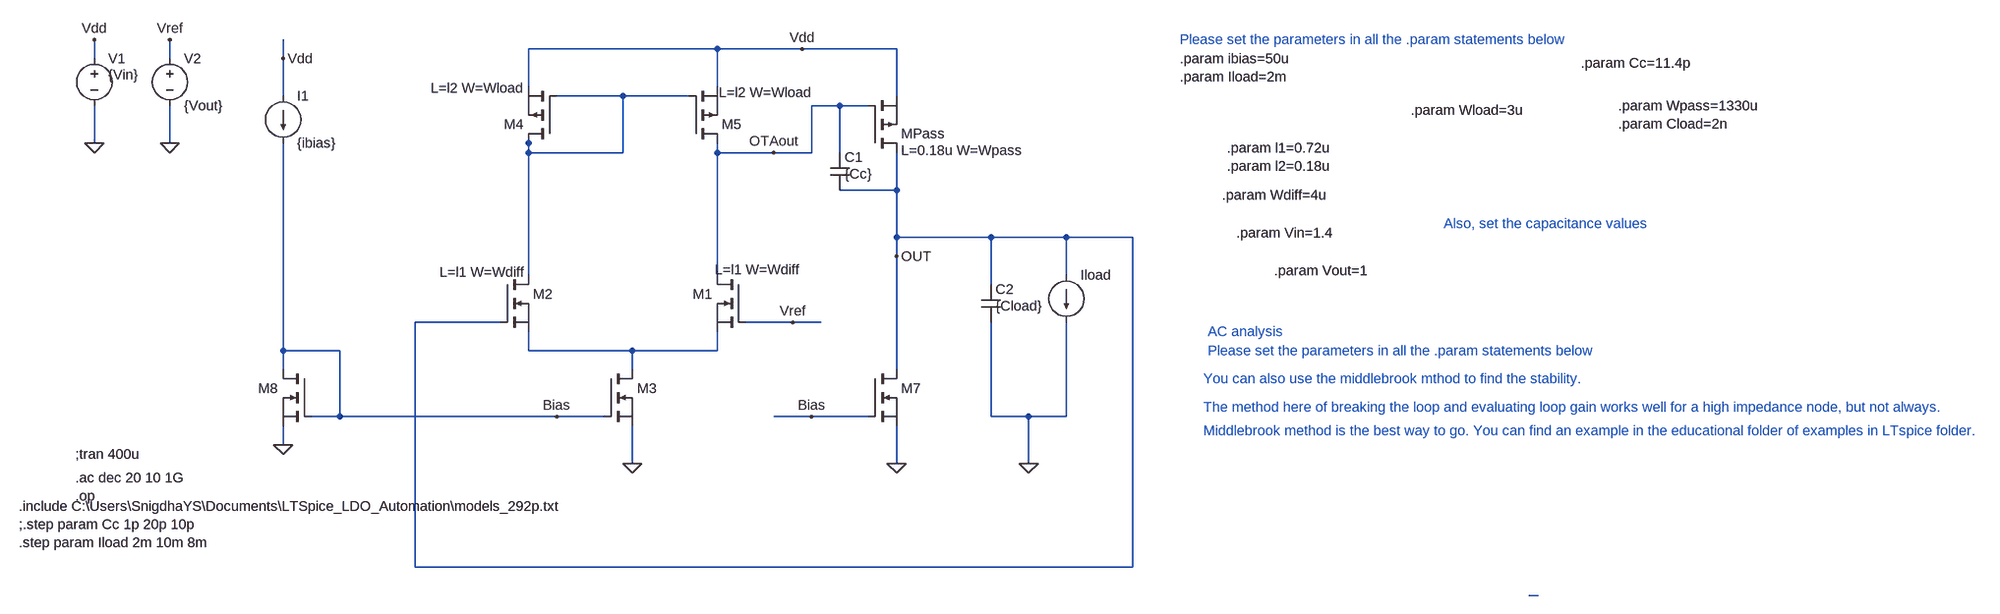
[diagram p0: schematic LDO_PSRR_IIIT.asc]
LDO_PSRR_IIIT.asc, the LTspice schematic file:
Version 4
SHEET 1 5048 1020
WIRE 288 -288 -32 -288
WIRE 432 -288 288 -288
WIRE 592 -288 432 -288
WIRE -768 -272 -768 -304
WIRE -640 -272 -640 -304
WIRE -448 -272 -448 -304
WIRE -32 -224 -32 -288
WIRE 288 -224 288 -288
WIRE -448 -208 -448 -272
WIRE 128 -208 16 -208
WIRE 240 -208 128 -208
WIRE 592 -208 592 -288
WIRE 496 -192 448 -192
WIRE 544 -192 496 -192
WIRE -768 -128 -768 -192
WIRE -640 -128 -640 -192
WIRE -32 -128 -32 -144
WIRE -32 -112 -32 -128
WIRE 128 -112 128 -208
WIRE 128 -112 -32 -112
WIRE 288 -112 288 -128
WIRE 384 -112 288 -112
WIRE 448 -112 448 -192
WIRE 448 -112 384 -112
WIRE 496 -112 496 -192
WIRE 592 -48 592 -112
WIRE 592 -48 496 -48
WIRE 592 32 592 -48
WIRE 752 32 592 32
WIRE 880 32 752 32
WIRE 992 32 880 32
WIRE 592 64 592 32
WIRE -32 96 -32 -112
WIRE 288 96 288 -112
WIRE 880 96 880 32
WIRE 752 112 752 32
WIRE -80 176 -224 176
WIRE 416 176 336 176
WIRE 464 176 416 176
WIRE -448 224 -448 -128
WIRE -352 224 -448 224
WIRE -32 224 -32 192
WIRE 144 224 -32 224
WIRE 288 224 288 192
WIRE 288 224 144 224
WIRE -448 256 -448 224
WIRE 144 256 144 224
WIRE 592 256 592 64
WIRE -352 336 -352 224
WIRE -352 336 -400 336
WIRE 16 336 -352 336
WIRE 96 336 16 336
WIRE 448 336 384 336
WIRE 544 336 448 336
WIRE 752 336 752 176
WIRE 816 336 752 336
WIRE 880 336 880 176
WIRE 880 336 816 336
WIRE -448 384 -448 352
WIRE 144 416 144 352
WIRE 592 416 592 352
WIRE 816 416 816 336
WIRE -224 592 -224 176
WIRE 992 592 992 32
WIRE 992 592 -224 592
WIRE 1680 640 1664 640
FLAG 144 416 0
FLAG 592 416 0
FLAG 448 336 Bias
FLAG 16 336 Bias
FLAG 592 64 OUT
FLAG -768 -128 0
FLAG -768 -304 Vdd
FLAG 432 -288 Vdd
FLAG -640 -128 0
FLAG -640 -304 Vref
FLAG 416 176 Vref
FLAG -448 384 0
FLAG -448 -272 Vdd
FLAG 816 416 0
FLAG 384 -112 OTAout
DATAFLAG 672 32 "$"
DATAFLAG -80 336 "$"
DATAFLAG 16 224 "$"
DATAFLAG 80 -112 "$"
DATAFLAG 160 -288 "$"
DATAFLAG 288 -16 "$"
SYMBOL nmos 336 96 M0
WINDOW 3 56 72 Invisible 2
WINDOW 39 -93 -9 Left 2
SYMATTR Value nmos292p
SYMATTR SpiceLine L=l1 W=Wdiff
SYMATTR InstName M1
SYMBOL nmos -80 96 R0
WINDOW 3 56 72 Invisible 2
WINDOW 39 -103 -5 Left 2
SYMATTR Value nmos292p
SYMATTR SpiceLine L=l1 W=Wdiff
SYMATTR InstName M2
SYMBOL nmos 96 256 R0
WINDOW 3 56 72 Invisible 2
SYMATTR Value nmos292p
SYMATTR InstName M3
SYMATTR SpiceLine L=1u W=10u
SYMBOL pmos 16 -128 R180
WINDOW 3 56 72 Invisible 2
WINDOW 39 55 94 Left 2
SYMATTR Value pmos292p
SYMATTR SpiceLine L=l2 W=Wload
SYMATTR InstName M4
SYMBOL pmos 240 -128 M180
WINDOW 3 56 72 Invisible 2
WINDOW 39 51 86 Left 2
SYMATTR Value pmos292p
SYMATTR SpiceLine L=l2 W=Wload
SYMATTR InstName M5
SYMBOL pmos 544 -112 M180
WINDOW 3 56 72 Invisible 2
WINDOW 39 56 4 Left 2
SYMATTR Value pmos292p
SYMATTR SpiceLine L=0.18u W=Wpass
SYMATTR InstName MPass
SYMBOL nmos 544 256 R0
WINDOW 3 56 72 Invisible 2
SYMATTR Value nmos292p
SYMATTR InstName M7
SYMATTR SpiceLine L=1u W=10u
SYMBOL voltage -768 -288 R0
WINDOW 3 24 44 Left 2
WINDOW 39 0 0 Left 2
SYMATTR Value {Vin}
SYMATTR Value2 AC 1
SYMATTR InstName V1
SYMBOL voltage -640 -288 R0
WINDOW 123 0 0 Left 0
WINDOW 39 0 0 Left 0
SYMATTR InstName V2
SYMATTR Value {Vout}
SYMBOL nmos -400 256 M0
WINDOW 3 56 72 Invisible 2
SYMATTR Value nmos292p
SYMATTR SpiceLine L=1u W=10u
SYMATTR InstName M8
SYMBOL current -448 -208 R0
SYMATTR InstName I1
SYMATTR Value {ibias}
SYMBOL current 880 96 R0
WINDOW 3 24 80 Invisible 2
WINDOW 123 0 0 Left 2
WINDOW 39 0 0 Left 2
SYMATTR Value {Iload}
SYMATTR InstName Iload
SYMBOL cap 736 112 R0
WINDOW 3 24 36 Left 2
SYMATTR Value {Cload}
SYMATTR InstName C2
SYMBOL cap 480 -112 R0
WINDOW 3 24 36 Left 2
SYMATTR Value {Cc}
SYMATTR InstName C1
TEXT -896 488 Left 2 !.include C:\\Users\\SnigdhaYS\\Documents\\LTSpice_LDO_Automation\\models_292p.txt\n;.step param Cc 1p 20p 10p\n.step param Iload 2m 10m 8m
TEXT -800 440 Left 2 !.ac dec 20 10 1G\n.op
TEXT 1072 -272 Left 2 !.param ibias=50u\n.param Iload=2m
TEXT 1152 -120 Left 2 !.param l1=0.72u\n.param l2=0.18u
TEXT -800 400 Left 2 !;tran 400u
TEXT 1072 -304 Left 2 ;Please set the parameters in all the .param statements below
TEXT 1464 -184 Left 2 !.param Wload=3u
TEXT 1144 -40 Left 2 !.param Wdiff=4u
TEXT 1816 -192 Left 2 !.param Wpass=1330u\n.param Cload=2n
TEXT 1520 8 Left 2 ;Also, set the capacitance values
TEXT 1112 272 Left 2 ;You can also use the middlebrook mthod to find the stability.
TEXT 1120 224 Left 2 ;Please set the parameters in all the .param statements below
TEXT 1112 320 Left 2 ;The method here of breaking the loop and evaluating loop gain works well for a high impedance node, but not always.
TEXT 1112 360 Left 2 ;Middlebrook method is the best way to go. You can find an example in the educational folder of examples in LTspice folder.
TEXT 1120 192 Left 2 ;AC analysis
TEXT 1168 24 Left 2 !.param Vin=1.4
TEXT 1232 88 Left 2 !.param Vout=1
TEXT 1752 -264 Left 2 !.param Cc=11.4p

The netlist it stands for:
* LDO_PSRR_IIIT.asc
M1 OTAout Vref N002 N002 nmos292p L=l1 W=Wdiff
M2 N001 OUT N002 N002 nmos292p L=l1 W=Wdiff
M3 N002 Bias 0 0 nmos292p L=1u W=10u
M4 N001 N001 Vdd Vdd pmos292p L=l2 W=Wload
M5 OTAout N001 Vdd Vdd pmos292p L=l2 W=Wload
MPass OUT OTAout Vdd Vdd pmos292p L=0.18u W=Wpass
M7 OUT Bias 0 0 nmos292p L=1u W=10u
V1 Vdd 0 {Vin} AC 1
V2 Vref 0 {Vout}
M8 Bias Bias 0 0 nmos292p L=1u W=10u
I1 Vdd Bias {ibias}
Iload OUT 0 {Iload}
C2 OUT 0 {Cload}
C1 OTAout OUT {Cc}
.model NMOS NMOS
.model PMOS PMOS
.lib standard.mos
.include C:\Users\SnigdhaYS\Documents\LTSpice_LDO_Automation\models_292p.txt
;.step param Cc 1p 20p 10p
.step param Iload 2m 10m 8m
.ac dec 20 10 1G
.op
.param ibias=50u
.param Iload=2m
.param l1=0.72u
.param l2=0.18u
;tran 400u
* Please set the parameters in all the .param statements below
.param Wload=3u
.param Wdiff=4u
.param Wpass=1330u
.param Cload=2n
* Also, set the capacitance values
* You can also use the middlebrook mthod to find the stability.
* Please set the parameters in all the .param statements below
* The method here of breaking the loop and evaluating loop gain works well for a high impedance node, but not always.
* Middlebrook method is the best way to go. You can find an example in the educational folder of examples in LTspice folder.
* AC analysis
.param Vin=1.4
.param Vout=1
.param Cc=11.4p
.backanno
.end

* Results of the author's LTspice run, read from the files saved beside the schematic
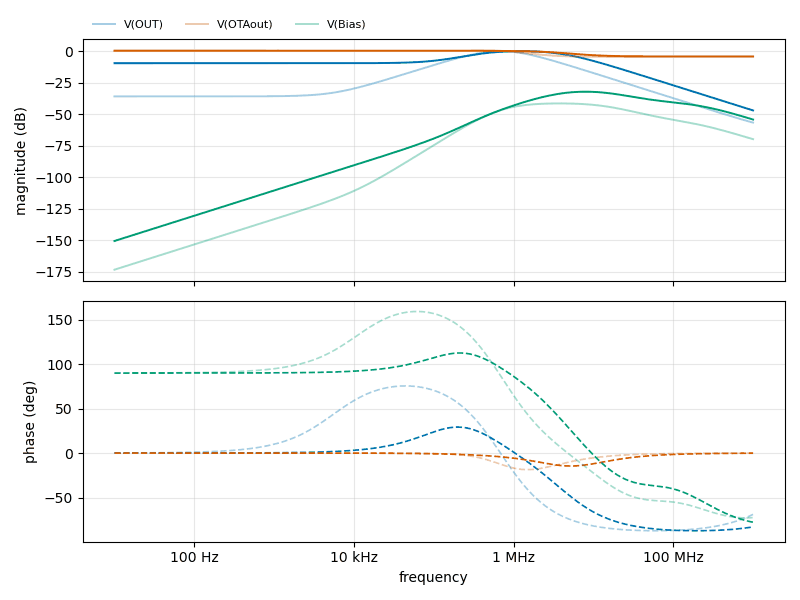
[diagram p1: AC Analysis of LDO_PSRR_IIIT.asc, plotted from the saved traces]
* AC Analysis, 2 runs:
*   V(OUT) [iload=0.002]: -35.90 dB at 10 Hz, -56.73 dB at 1 GHz, peak -0.03 dB at 707.9 kHz, 3 dB below the peak at 288.6 kHz and 1.651 MHz
*   V(OUT) [iload=0.01]: -9.59 dB at 10 Hz, -47.05 dB at 1 GHz, peak -0.05 dB at 1.259 MHz, 3 dB below the peak at 302.5 kHz and 4.751 MHz
*   V(OTAout) [iload=0.002]: 0.26 dB at 10 Hz, -4.59 dB at 1 GHz, peak 0.57 dB at 398.1 kHz, 3 dB below the peak at 1.884 MHz
*   V(OTAout) [iload=0.01]: 0.34 dB at 10 Hz, -4.23 dB at 1 GHz, peak 0.34 dB at 10 Hz, 3 dB below the peak at 7.186 MHz
*   V(Bias) [iload=0.002]: -173.37 dB at 10 Hz, -69.86 dB at 1 GHz, peak -41.48 dB at 3.548 MHz, 3 dB below the peak at 957.6 kHz and 16.67 MHz
*   V(Bias) [iload=0.01]: -150.61 dB at 10 Hz, -54.26 dB at 1 GHz, peak -32.17 dB at 7.943 MHz, 3 dB below the peak at 2.832 MHz and 24.51 MHz
* From the log:
*   Semiconductor Device Operating Points:
*                           --- BSIM3 MOSFETS ---
*   Name:       mpass        m5          m4          m8          m7
*   Model:    pmos292p    pmos292p    pmos292p    nmos292p    nmos292p
*   Id:       -2.00e-03   -2.40e-07   -2.36e-07    5.00e-07    5.18e-07
*   Vgs:      -5.19e-01   -4.47e-01   -4.47e-01    3.66e-01    3.66e-01
*   Vds:      -2.02e-01   -5.19e-01   -4.47e-01    3.66e-01    5.98e-01
*   Vbs:       0.00e+00    0.00e+00    0.00e+00    0.00e+00    0.00e+00
*   Vth:      -4.85e-01   -4.42e-01   -4.42e-01    4.21e-01    4.21e-01
*   Vdsat:    -7.22e-02   -5.66e-02   -5.66e-02    3.85e-02    3.85e-02
*   Gm:        3.88e-02    5.05e-06    4.98e-06    1.21e-05    1.25e-05
*   Gds:       1.18e-03    4.95e-08    5.09e-08    8.19e-08    7.41e-08
*   Gmb        1.16e-02    1.52e-06    1.50e-06    3.60e-06    3.72e-06
*   Cbd:       0.00e+00    0.00e+00    0.00e+00    0.00e+00    0.00e+00
*   Cbs:       0.00e+00    0.00e+00    0.00e+00    0.00e+00    0.00e+00
*   Cgsov:     1.61e-12    9.01e-16    9.01e-16    8.58e-15    8.58e-15
*   Cgdov:     1.61e-12    9.01e-16    9.01e-16    8.58e-15    8.58e-15
*   Cgbov:     1.21e-19    3.01e-19    3.01e-19    9.66e-19    9.66e-19
*   dQgdVgb:   4.64e-12    3.46e-15    3.46e-15    4.59e-14    4.60e-14
*   dQgdVdb:  -1.61e-12   -8.99e-16   -8.99e-16   -8.56e-15   -8.55e-15
*   dQgdVsb:  -2.82e-12   -2.16e-15   -2.16e-15   -1.98e-14   -2.00e-14
*   dQddVgb:  -2.11e-12   -1.42e-15   -1.42e-15   -1.34e-14   -1.34e-14
*   dQddVdb:   1.61e-12    9.00e-16    9.00e-16    8.57e-15    8.56e-15
*   dQddVsb:   6.52e-13    6.92e-16    6.91e-16    6.41e-15    6.48e-15
*   dQbdVgb:  -4.31e-13   -6.09e-16   -6.09e-16   -1.91e-14   -1.91e-14
*   dQbdVdb:  -2.97e-15    2.59e-20   -5.71e-20    5.49e-19    2.39e-18
*   dQbdVsb:  -8.88e-14   -1.23e-16   -1.23e-16   -1.55e-15   -1.56e-15
*   Name:        m3          m2          m1
*   Model:    nmos292p    nmos292p    nmos292p
*   Id:        4.76e-07    2.36e-07    2.40e-07
*   Vgs:       3.66e-01    4.57e-01    4.59e-01
*   Vds:       1.41e-01    2.12e-01    1.40e-01
*   Vbs:       0.00e+00    0.00e+00    0.00e+00
*   Vth:       4.22e-01    4.25e-01    4.26e-01
*   Vdsat:     3.84e-02    5.95e-02    6.02e-02
*   Gm:        1.15e-05    4.99e-06    5.01e-06
*   Gds:       1.79e-07    8.86e-08    1.65e-07
*   Gmb        3.43e-06    1.44e-06    1.45e-06
*   Cbd:       0.00e+00    0.00e+00    0.00e+00
*   Cbs:       0.00e+00    0.00e+00    0.00e+00
*   Cgsov:     8.58e-15    2.82e-16    2.82e-16
*   Cgdov:     8.58e-15    2.82e-16    2.82e-16
*   Cgbov:     9.66e-19    5.06e-19    5.06e-19
*   dQgdVgb:   4.59e-14    1.50e-15    1.51e-15
*   dQgdVdb:  -8.59e-15   -2.80e-16   -2.83e-16
*   dQgdVsb:  -1.97e-14   -1.07e-15   -1.09e-15
*   dQddVgb:  -1.34e-14   -6.14e-16   -6.23e-16
*   dQddVdb:   8.59e-15    2.81e-16    2.85e-16
*   dQddVsb:   6.37e-15    4.39e-16    4.49e-16
*   dQbdVgb:  -1.91e-14   -2.72e-16   -2.67e-16
*   dQbdVdb:  -2.77e-17   -1.15e-18   -4.56e-18
*   dQbdVsb:  -1.58e-15   -8.95e-17   -9.30e-17